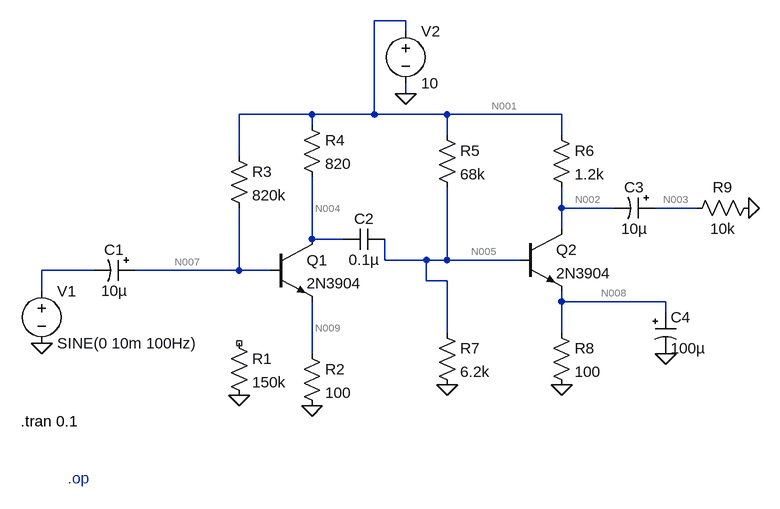
[diagram p0: schematic BJT Differential Amplifier (Long-Tailed Pair).asc]
BJT Differential Amplifier (Long-Tailed Pair).asc, the LTspice schematic file:
Version 4.1
SHEET 1 1140 680
WIRE 592 -272 544 -272
WIRE 592 -256 592 -272
WIRE 592 -160 592 -176
WIRE 448 -128 336 -128
WIRE 544 -128 544 -272
WIRE 544 -128 448 -128
WIRE 656 -128 544 -128
WIRE 832 -128 656 -128
WIRE 448 -112 448 -128
WIRE 656 -96 656 -128
WIRE 832 -96 832 -128
WIRE 336 -64 336 -128
WIRE 832 16 832 -16
WIRE 912 16 832 16
WIRE 1040 16 976 16
WIRE 832 48 832 16
WIRE 448 64 448 -32
WIRE 496 64 448 64
WIRE 560 96 560 64
WIRE 624 96 560 96
WIRE 656 96 656 -16
WIRE 656 96 624 96
WIRE 768 96 656 96
WIRE 112 112 32 112
WIRE 336 112 336 16
WIRE 336 112 176 112
WIRE 384 112 336 112
WIRE 624 128 624 96
WIRE 656 128 624 128
WIRE 32 144 32 112
WIRE 832 160 832 144
WIRE 992 160 832 160
WIRE 992 176 992 160
WIRE 656 208 656 128
WIRE 832 208 832 160
WIRE 448 240 448 160
FLAG 32 224 0
FLAG 336 304 0
FLAG 448 320 0
FLAG 832 288 0
FLAG 656 288 0
FLAG 992 240 0
FLAG 592 -160 0
FLAG 1120 16 0
SYMBOL voltage 32 128 R0
WINDOW 123 0 0 Left 0
WINDOW 39 0 0 Left 0
SYMATTR InstName V1
SYMATTR Value SINE(0 10m 100Hz)
SYMBOL polcap 176 96 R90
WINDOW 0 0 32 VBottom 2
WINDOW 3 32 32 VTop 2
SYMATTR InstName C1
SYMATTR Value 10µ
SYMBOL res 320 208 R0
SYMATTR InstName R1
SYMATTR Value 150k
SYMBOL res 432 224 R0
SYMATTR InstName R2
SYMATTR Value 100
SYMBOL res 320 -80 R0
SYMATTR InstName R3
SYMATTR Value 820k
SYMBOL res 432 -128 R0
SYMATTR InstName R4
SYMATTR Value 820
SYMBOL npn 384 64 R0
SYMATTR InstName Q1
SYMATTR Value 2N3904
SYMBOL cap 560 48 R90
WINDOW 0 0 32 VBottom 2
WINDOW 3 32 32 VTop 2
SYMATTR InstName C2
SYMATTR Value 0.1µ
SYMBOL res 640 -112 R0
SYMATTR InstName R5
SYMATTR Value 68k
SYMBOL res 816 -112 R0
SYMATTR InstName R6
SYMATTR Value 1.2k
SYMBOL res 640 192 R0
SYMATTR InstName R7
SYMATTR Value 6.2k
SYMBOL res 816 192 R0
SYMATTR InstName R8
SYMATTR Value 100
SYMBOL npn 768 48 R0
SYMATTR InstName Q2
SYMATTR Value 2N3904
SYMBOL voltage 592 -272 R0
WINDOW 123 0 0 Left 0
WINDOW 39 0 0 Left 0
SYMATTR InstName V2
SYMATTR Value 10
SYMBOL polcap 976 0 R90
WINDOW 0 0 32 VBottom 2
WINDOW 3 32 32 VTop 2
SYMATTR InstName C3
SYMATTR Value 10µ
SYMBOL polcap 976 176 R0
SYMATTR InstName C4
SYMATTR Value 100µ
SYMBOL res 1136 0 R90
WINDOW 0 0 56 VBottom 2
WINDOW 3 32 56 VTop 2
SYMATTR InstName R9
SYMATTR Value 10k
TEXT 0 344 Left 2 !.tran 0.1
TEXT 72 432 Left 2 ;.op

The netlist it stands for:
* BJT Differential Amplifier (Long-Tailed Pair).asc
V1 N006 0 SINE(0 10m 100Hz)
C1 N007 N006 10µ
R1 NC_01 0 150k
R2 N009 0 100
R3 N001 N007 820k
R4 N001 N004 820
Q1 N004 N007 N009 0 2N3904
C2 N005 N004 0.1µ
R5 N001 N005 68k
R6 N001 N002 1.2k
R7 N005 0 6.2k
R8 N008 0 100
Q2 N002 N005 N008 0 2N3904
V2 N001 0 10
C3 N003 N002 10µ
C4 N008 0 100µ
R9 0 N003 10k
.model NPN NPN
.model PNP PNP
.lib standard.bjt
.tran 0.1
* .op
.backanno
.end

* Results of the author's LTspice run, read from the files saved beside the schematic
* Operating Point, zero values left out:
*   V(n001) = 10 V
*   V(n002) = 8.249 V
*   V(n004) = 7.168 V
*   V(n005) = 809.8 mV
*   V(n007) = 1.033 V
*   V(n008) = 146.4 mV
*   V(n009) = 346.5 mV
*   I(R2) = 3.465 mA
*   I(R3) = 10.94 µA
*   I(R4) = 3.454 mA
*   I(R5) = 135.2 µA
*   I(R6) = 1.459 mA
*   I(R7) = 130.6 µA
*   I(R8) = 1.464 mA
*   I(V2) = -5.059 mA
*   Ib(Q1) = 10.94 µA
*   Ib(Q2) = 4.543 µA
*   Ic(Q1) = 3.454 mA
*   Ic(Q2) = 1.459 mA
*   Ie(Q1) = -3.465 mA
*   Ie(Q2) = -1.464 mA
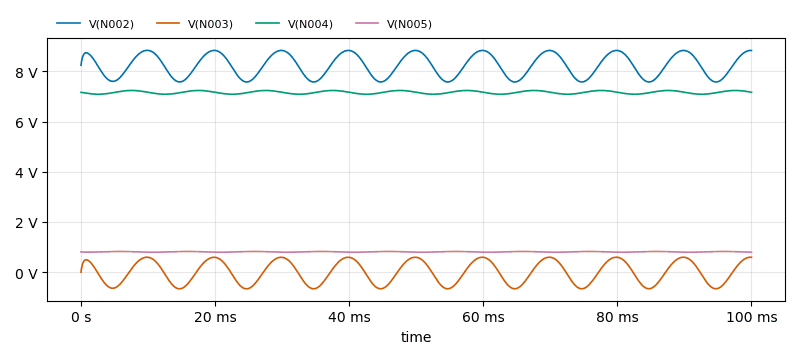
[diagram p1: Transient Analysis of BJT Differential Amplifier (Long-Tailed Pair).asc, plotted from the saved traces]
* Transient Analysis, 1 run:
*   V(N002): min 7.582 V, max 8.842 V, average 8.241 V, rms 8.253 V, last 8.837 V
*   V(N003): min -664.1 mV, max 594.6 mV, average -4.306 mV, rms 444 mV, last 592.8 mV
*   V(N004): min 7.093 V, max 7.243 V, average 7.168 V, rms 7.168 V, last 7.171 V
*   V(N005): min 793.9 mV, max 825.2 mV, average 809.7 mV, rms 809.8 mV, last 795.5 mV